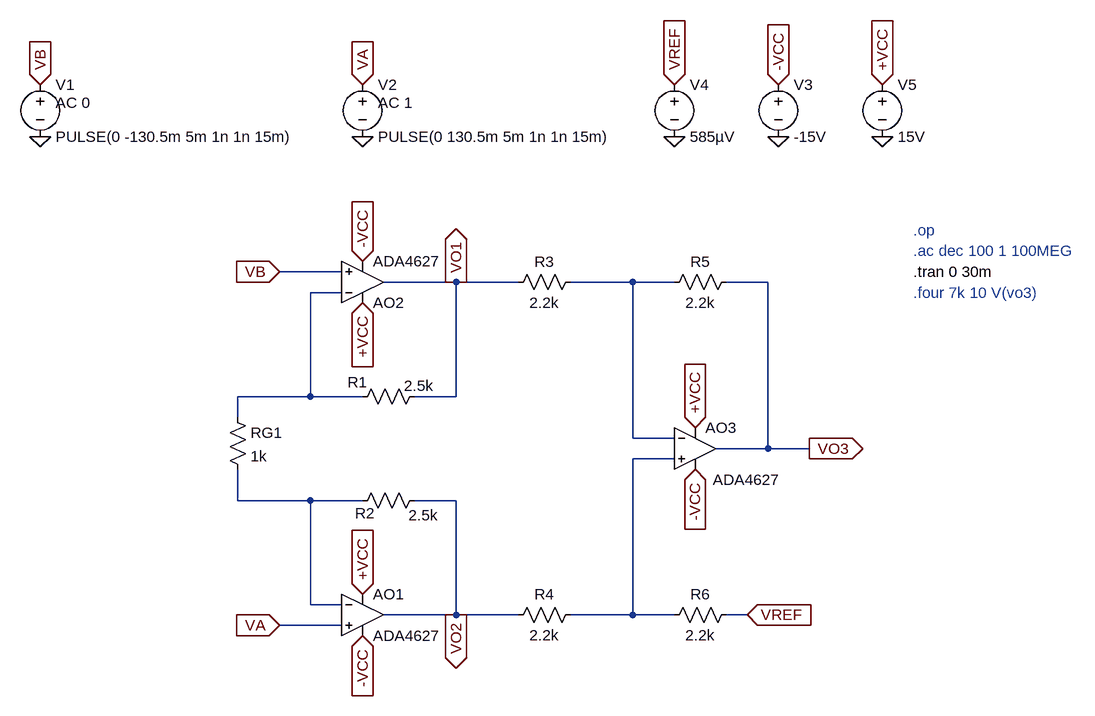
[diagram p0: schematic SR.asc]
SR.asc, the LTspice schematic file:
Version 4.1
SHEET 1 1344 820
WIRE -64 144 -160 144
WIRE 112 160 0 160
WIRE 208 160 112 160
WIRE 384 160 288 160
WIRE 448 160 384 160
WIRE 592 160 528 160
WIRE -64 176 -112 176
WIRE -112 336 -112 176
WIRE -112 336 -224 336
WIRE -32 336 -112 336
WIRE 112 336 112 160
WIRE 112 336 48 336
WIRE -224 368 -224 336
WIRE 384 400 384 160
WIRE 448 400 384 400
WIRE 592 416 592 160
WIRE 592 416 512 416
WIRE 656 416 592 416
WIRE 448 432 384 432
WIRE -224 496 -224 448
WIRE -112 496 -224 496
WIRE -32 496 -112 496
WIRE 112 496 48 496
WIRE -112 656 -112 496
WIRE -64 656 -112 656
WIRE 112 672 112 496
WIRE 112 672 0 672
WIRE 208 672 112 672
WIRE 384 672 384 432
WIRE 384 672 288 672
WIRE 448 672 384 672
WIRE 560 672 528 672
WIRE -64 688 -160 688
FLAG -160 144 VB
IOPIN -160 144 In
FLAG -160 688 VA
IOPIN -160 688 In
FLAG -32 128 -VCC
IOPIN -32 128 In
FLAG -32 192 +VCC
IOPIN -32 192 In
FLAG -32 704 -VCC
IOPIN -32 704 In
FLAG -32 640 +VCC
IOPIN -32 640 In
FLAG 560 672 VREF
IOPIN 560 672 In
FLAG 112 160 VO1
IOPIN 112 160 Out
FLAG 112 672 VO2
IOPIN 112 672 Out
FLAG 480 448 -VCC
IOPIN 480 448 In
FLAG 480 384 +VCC
IOPIN 480 384 In
FLAG 656 416 VO3
IOPIN 656 416 Out
FLAG -528 -64 0
FLAG -528 -144 VB
IOPIN -528 -144 In
FLAG -32 -64 0
FLAG -32 -144 VA
IOPIN -32 -144 In
FLAG 608 -64 0
FLAG 768 -64 0
FLAG 768 -144 +VCC
IOPIN 768 -144 In
FLAG 608 -144 -VCC
IOPIN 608 -144 In
FLAG 448 -64 0
FLAG 448 -144 VREF
IOPIN 448 -144 In
DATAFLAG 592 416 ""
SYMBOL OpAmps\\ADA4627 -32 608 R0
SYMATTR InstName AO1
SYMBOL OpAmps\\ADA4627 -32 224 M180
SYMATTR InstName AO2
SYMBOL OpAmps\\ADA4627 480 352 R0
WINDOW 3 27 112 Left 2
SYMATTR InstName AO3
SYMBOL res 64 320 R90
WINDOW 0 10 104 VBottom 2
WINDOW 3 -16 9 VTop 2
SYMATTR InstName R1
SYMATTR Value 2.5k
SYMBOL res 64 480 R90
WINDOW 0 51 92 VBottom 2
WINDOW 3 23 2 VTop 2
SYMATTR InstName R2
SYMATTR Value 2.5k
SYMBOL res -240 352 R0
SYMATTR InstName RG1
SYMATTR Value 1k
SYMBOL res 304 144 R90
WINDOW 0 0 56 VBottom 2
WINDOW 3 32 56 VTop 2
SYMATTR InstName R3
SYMATTR Value 2.2k
SYMBOL res 304 656 R90
WINDOW 0 0 56 VBottom 2
WINDOW 3 32 56 VTop 2
SYMATTR InstName R4
SYMATTR Value 2.2k
SYMBOL res 544 144 R90
WINDOW 0 0 56 VBottom 2
WINDOW 3 32 56 VTop 2
SYMATTR InstName R5
SYMATTR Value 2.2k
SYMBOL res 544 656 R90
WINDOW 0 0 56 VBottom 2
WINDOW 3 32 56 VTop 2
SYMATTR InstName R6
SYMATTR Value 2.2k
SYMBOL voltage -528 -160 R0
WINDOW 123 24 44 Left 2
WINDOW 39 0 0 Left 0
SYMATTR Value2 AC 0
SYMATTR InstName V1
SYMATTR Value PULSE(0 -130.5m 5m 1n 1n 15m)
SYMBOL voltage -32 -160 R0
WINDOW 123 24 44 Left 2
WINDOW 39 0 0 Left 0
SYMATTR Value2 AC 1
SYMATTR InstName V2
SYMATTR Value PULSE(0 130.5m 5m 1n 1n 15m)
SYMBOL voltage 608 -160 R0
WINDOW 123 0 0 Left 0
WINDOW 39 0 0 Left 0
SYMATTR InstName V3
SYMATTR Value -15V
SYMBOL voltage 448 -160 R0
WINDOW 123 0 0 Left 0
WINDOW 39 0 0 Left 0
SYMATTR InstName V4
SYMATTR Value 585µV
SYMBOL voltage 768 -160 R0
WINDOW 123 24 44 Left 2
WINDOW 39 0 0 Left 0
SYMATTR InstName V5
SYMATTR Value 15V
TEXT 816 112 Left 2 ;.ac dec 100 1 100MEG
TEXT 816 144 Left 2 !.tran 0 30m
TEXT 816 80 Left 2 ;.op
TEXT 816 176 Left 2 ;.four 7k 10 V(vo3)

The netlist it stands for:
* SR.asc
X§AO1 VA N004 +VCC -VCC VO2 ADA4627  ; pins In+ In- V+ V- OUT
X§AO2 VB N002 +VCC -VCC VO1 ADA4627  ; pins In+ In- V+ V- OUT
X§AO3 N003 N001 +VCC -VCC VO3 ADA4627  ; pins In+ In- V+ V- OUT
R1 VO1 N002 2.5k
R2 VO2 N004 2.5k
RG1 N002 N004 1k
R3 N001 VO1 2.2k
R4 N003 VO2 2.2k
R5 VO3 N001 2.2k
R6 VREF N003 2.2k
V1 VB 0 PULSE(0 -130.5m 5m 1n 1n 15m) AC 0
V2 VA 0 PULSE(0 130.5m 5m 1n 1n 15m) AC 1
V3 -VCC 0 -15V
V4 VREF 0 585µV
V5 +VCC 0 15V
* .ac dec 100 1 100MEG
.tran 0 30m
* .op
* .four 7k 10 V(vo3)
.backanno
.end